# EAGLE schematic smartsensorPowered (EAGLE 7.4.0)
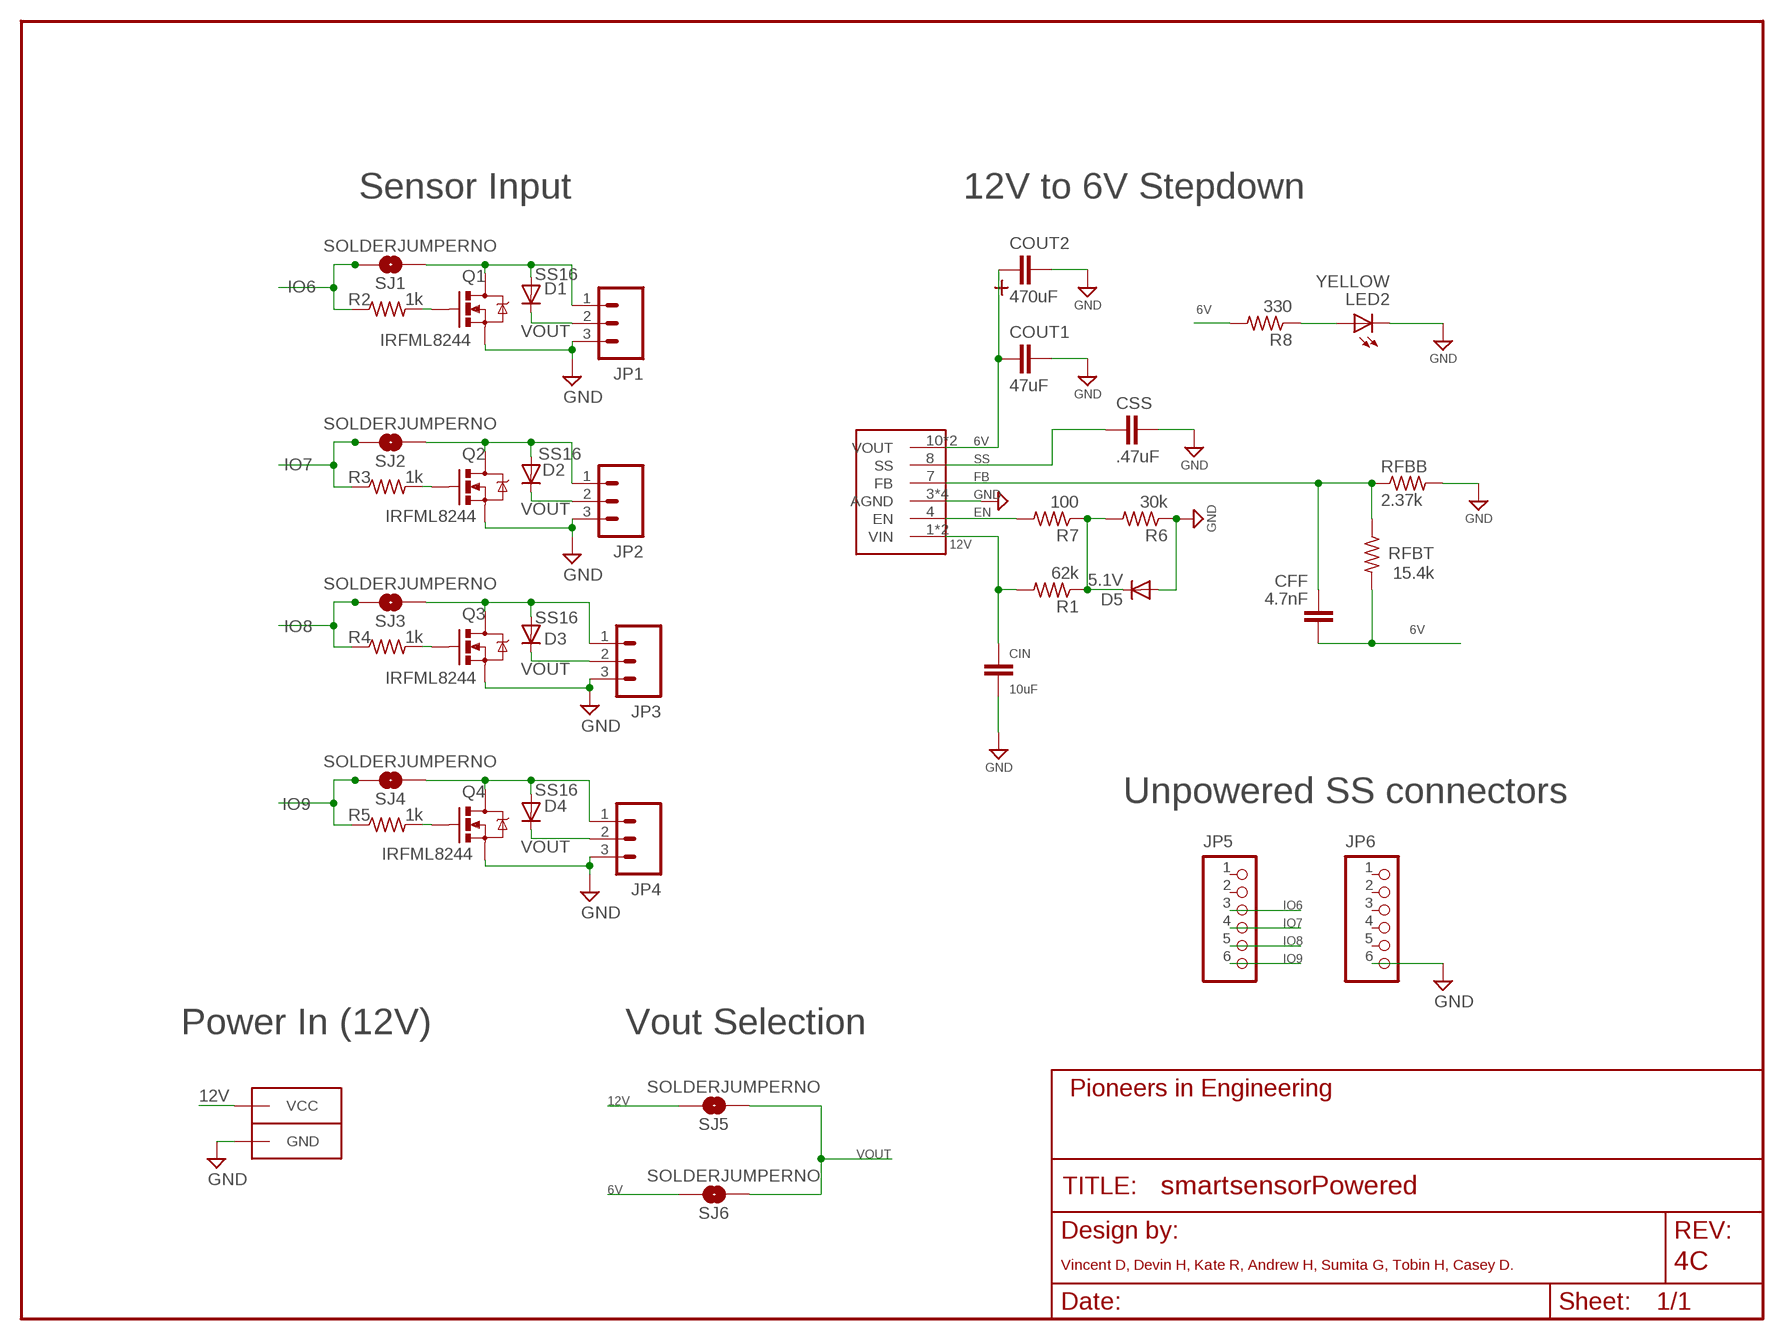
[diagram p0: schematic, sheet 1]
FRAME1 (FRAME-LETTER): AUTHOR: Vincent D, Devin H, Kate R, Andrew H, Sumita G, Tobin H, Casey D.; REVISION: 4C

## Parts
CFF  4.7nF  CAP0603-CAP  [0603-CAP]
CIN  10uF  CAP1206  [1206]
CONN1  ANDERSONVERTICAL  [ANDERSON_VERTICAL]
COUT1  47uF  CAP1206  [1206]
COUT2  470uF  TANT_CASE_E  [TANT_CASE_E]
CSS  .47uF  CAP0603-CAP  [0603-CAP]
D1  SS16  DIODESMA-ALT  [SMA-DIODE_ALT]
D2  SS16  DIODESMA-ALT  [SMA-DIODE_ALT]
D3  SS16  DIODESMA-ALT  [SMA-DIODE_ALT]
D4  SS16  DIODESMA-ALT  [SMA-DIODE_ALT]
D5  5.1V  DIODESOD-323  [SOD-323]
JP1  M031X03-MTA  [1X03-MTA]
JP2  M031X03-MTA  [1X03-MTA]
JP3  M031X03-MTA  [1X03-MTA]
JP4  M031X03-MTA  [1X03-MTA]
JP5  PINHD-1X6  [1X06]
JP6  PINHD-1X6  [1X06]
LED2  YELLOW  LED0805  [LED-0805]
Q1  IRFML8244  MOSFET-NCHANNELSMD  [SOT23-3]
Q2  IRFML8244  MOSFET-NCHANNELSMD  [SOT23-3]
Q3  IRFML8244  MOSFET-NCHANNELSMD  [SOT23-3]
Q4  IRFML8244  MOSFET-NCHANNELSMD  [SOT23-3]
R1  62k  R-US_R0603  [R0603]
R2  1k  R-US_R0603  [R0603]
R3  1k  R-US_R0603  [R0603]
R4  1k  R-US_R0603  [R0603]
R5  1k  R-US_R0603  [R0603]
R6  30k  R-US_R0603  [R0603]
R7  100  R-US_R0603  [R0603]
R8  330  R-US_R0603  [R0603]
RFBB  2.37k  R-US_R0603  [R0603]
RFBT  15.4k  R-US_R0603  [R0603]
SJ1  SOLDERJUMPERNO  [SJ_2S-NO]
SJ2  SOLDERJUMPERNO  [SJ_2S-NO]
SJ3  SOLDERJUMPERNO  [SJ_2S-NO]
SJ4  SOLDERJUMPERNO  [SJ_2S-NO]
SJ5  SOLDERJUMPERNO  [SJ_2S-NO]
SJ6  SOLDERJUMPERNO  [SJ_2S-NO]
U$3  LMZ12010  [LMZ12010]

## Nets
6V: CFF.1 COUT1.1 COUT2.POS R8.2 RFBT.2 SJ6.1 U$3.10(VOUT) U$3.11(VOUT)
6V_IF_SERVO1: D1.A JP1.1 Q1.3(D) SJ1.2
6V_IF_SERVO2: D2.A JP2.1 Q2.3(D) SJ2.2
6V_IF_SERVO3: D3.A JP3.1 Q3.3(D) SJ3.2
6V_IF_SERVO4: D4.A JP4.1 Q4.3(D) SJ4.2
12V: CIN.1 CONN1.PIN2(VCC) R1.2 SJ5.1 U$3.1(VIN) U$3.2(VIN)
DIODE: D5.2(C) R1.1 R6.2 R7.1
EN: R7.2 U$3.4(EN)
FB: CFF.2 RFBB.1 RFBT.1 U$3.7(FB)
GND: CIN.2 CONN1.PIN1(GND) COUT1.2 COUT2.NEG CSS.2 D5.1(A) JP1.3 JP2.3 JP3.3 JP4.3 JP6.6 LED2.C Q1.2(S) Q2.2(S) Q3.2(S) Q4.2(S) R6.1 RFBB.2 U$3.3(AGND) U$3.5(AGND) U$3.6(AGND) U$3.GND(AGND)
IO6: JP5.3 R2.1 SJ1.1
IO7: JP5.4 R3.1 SJ2.1
IO8: JP5.5 R4.1 SJ3.1
IO9: JP5.6 R5.1 SJ4.1
N$2: Q1.1(G) R2.2
N$3: LED2.A R8.1
N$5: Q2.1(G) R3.2
N$8: Q3.1(G) R4.2
N$11: Q4.1(G) R5.2
SS: CSS.1 U$3.8(SS)
VOUT: D1.C D2.C D3.C D4.C JP1.2 JP2.2 JP3.2 JP4.2 SJ5.2 SJ6.2
Unconnected: JP5.1 JP5.2 JP6.1 JP6.2 JP6.3 JP6.4 JP6.5

## Notes on the sheet
- Sensor Input | 12V to 6V Stepdown
- Unpowered SS connectors
- Power In (12V) | Vout Selection

## Library data of the parts
CFF CIN COUT1 CSS = pie:CAP: Capacitor Standard 0603 ceramic capacitor, and 0.1" leaded capacitor.; PIE-INT-REF-NUM: CAPACITOR-GENERIC
CONN1 = pie:ANDERSON: 2-pin 25A Anderson Connector http://www.alliedelec.com/images/products/datasheets/bm/ANDERSON_POWER_PRODUCTS/70162018.pdf; PIE-INT-REF-NUM: Anderson
COUT2 = pie:TANT_CASE_E; PIE-INT-REF-NUM: CAPACITOR-TANTALUM
D1-D5 = pie:DIODE: Diode These are standard reverse protection diodes and small signal diodes. SMA package can handle up to about 1A. SOD-323 can handle about 200mA. What the SOD-323 package when ordering, there are some mfgs out there that are 5-pin packages.; PIE-INT-REF-NUM: DIODE
JP1-JP4 = pie:M03: 3-pin 0.1-inch header and MTA connector; PIE-INT-REF-NUM: MTA
JP5 JP6 = pie:PINHD-1X6: 6-pin 0.1-inch header; PARTNUMBER: 965
LED2 = pie:LED: LEDs Standard schematic elements and footprints for 5mm, 3mm, 1206, and 0603 sized LEDs. 5mm - Spark Fun Electronics SKU : COM-00529 (and others); PIE-INT-REF-NUM: LED
Q1-Q4 = pie:MOSFET-NCHANNEL: N-Type MOSFET, SOT23-3 Package; PIE-INT-REF-NUM: NMOS
R1-R8 RFBB RFBT = pie:R-US_: RESISTOR, American symbol; PIE-INT-REF-NUM: RESISTOR-GENERIC
SJ1-SJ6 = pie:SOLDERJUMPER: Solder Jumper Standard SMD solder jumper. Used to automate production. Two varients : Normally Open and Normally Closed are the same, but have different paste layers. NC will have a large amount of paste and should jumper during reflow.; PIE-INT-REF-NUM: DNL
U$3 = pie:LMZ12010; PIE-INT-REF-NUM: LMZ12010